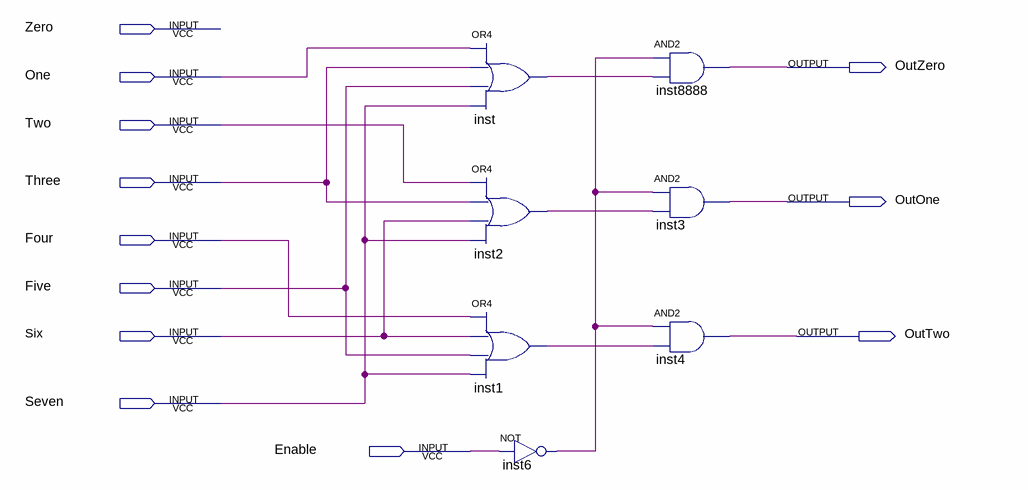
[diagram p0: schematic sheet]
// Quartus schematic EightBitEncoder.bdf as structural Verilog: 7 symbols, 12 pins
module EightBitEncoder (
  input  Zero,
  input  One,
  input  Two,
  input  Three,
  input  Four,
  input  Five,
  input  Six,
  input  Seven,
  input  Enable,
  output OutZero,
  output OutOne,
  output OutTwo
);

  wire inst1_out, inst2_out, inst6_out, inst_out;

  or inst (inst_out, One, Three, Five, Seven);
  or inst2 (inst2_out, Two, Three, Six, Seven);
  or inst1 (inst1_out, Four, Six, Five, Seven);
  not inst6 (inst6_out, Enable);
  and inst8888 (OutZero, inst6_out, inst_out);
  and inst3 (OutOne, inst6_out, inst2_out);
  and inst4 (OutTwo, inst6_out, inst1_out);
endmodule
